# EAGLE schematic Sifteo Thundercracker Master Dev (EAGLE 5.11)
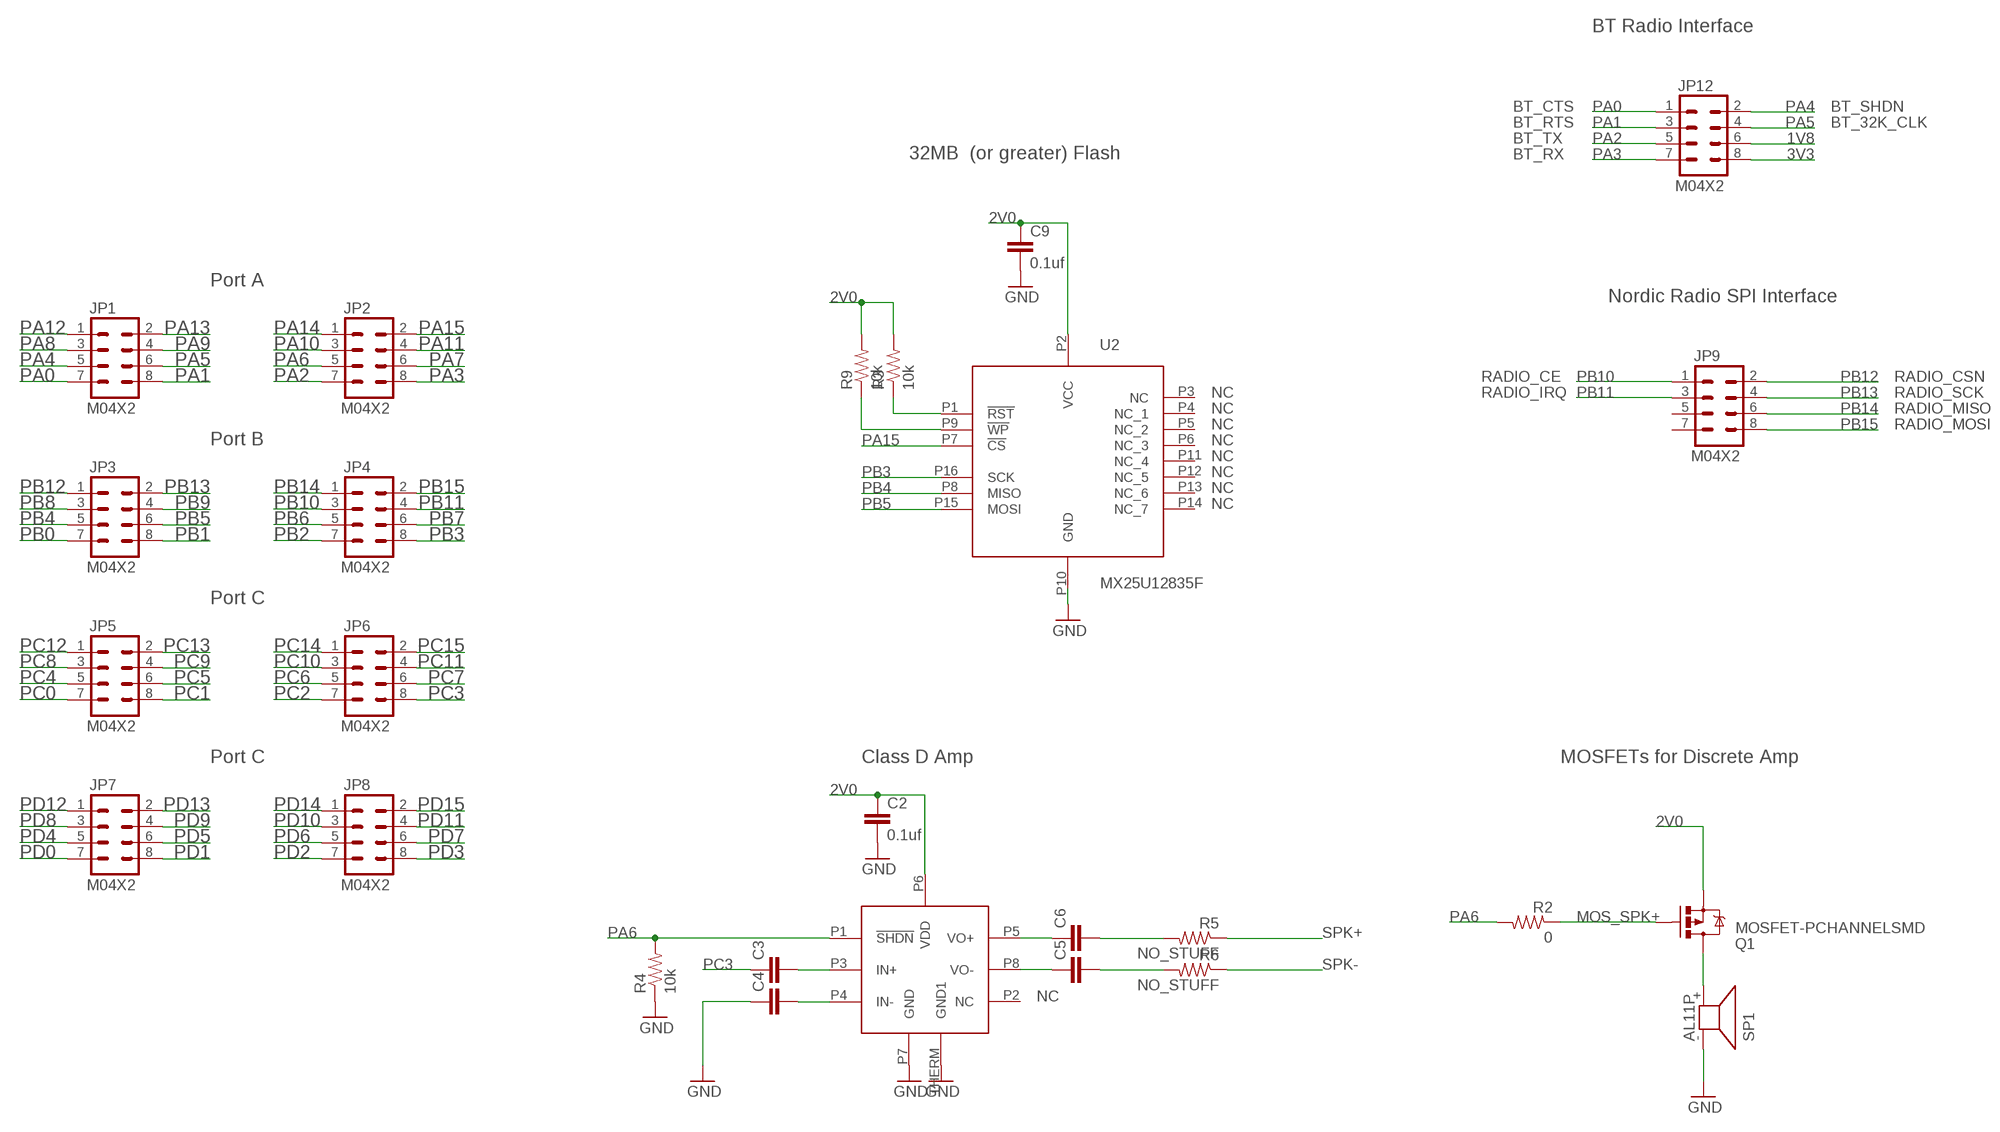
[diagram p0: schematic, sheet 1, part 1 of 2]
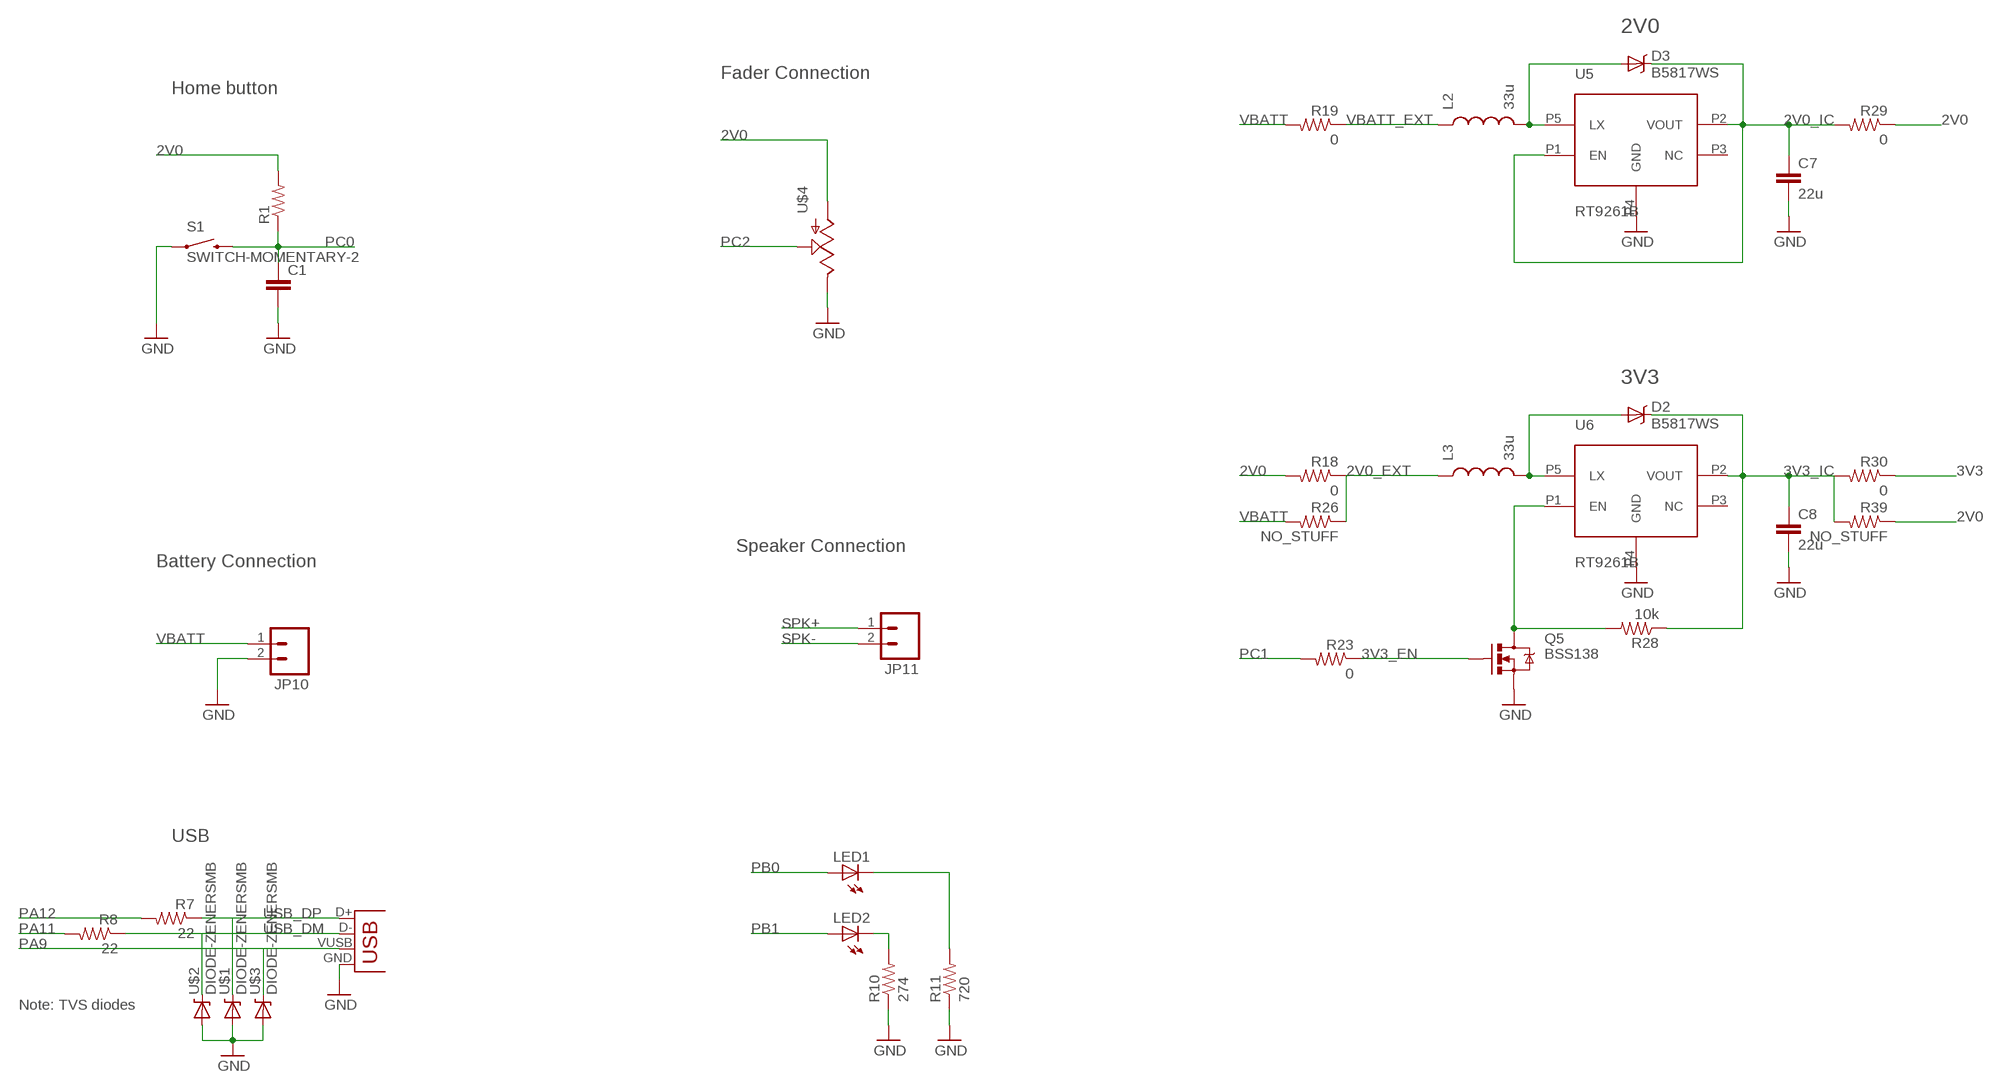
[diagram p1: schematic, sheet 1, part 2 of 2]

## Parts
C1  CAP0603-CAP  [0603-CAP]
C2  0.1uf  CAP0603-CAP  [0603-CAP]
C3  CAP0603-CAP  [0603-CAP]
C4  CAP0603-CAP  [0603-CAP]
C5  CAP0603-CAP  [0603-CAP]
C6  CAP0603-CAP  [0603-CAP]
C7  22u  CAP0603-CAP  [0603-CAP]
C8  22u  CAP0603-CAP  [0603-CAP]
C9  0.1uf  CAP0603-CAP  [0603-CAP]
D2  B5817WS  [SOD-323]
D3  B5817WS  [SOD-323]
JP1  M04X2  [2X4]
JP2  M04X2  [2X4]
JP3  M04X2  [2X4]
JP4  M04X2  [2X4]
JP5  M04X2  [2X4]
JP6  M04X2  [2X4]
JP7  M04X2  [2X4]
JP8  M04X2  [2X4]
JP9  M04X2  [2X4]
JP10  M02PTH  [1X02]
JP11  M02PTH  [1X02]
JP12  M04X2  [2X4]
L2  33u  INDUCTOR0805  [0805]
L3  33u  INDUCTOR0805  [0805]
LED1  LED5MM  [LED5MM]
LED2  LED5MM  [LED5MM]
Q1  MOSFET-PCHANNELSMD  [SOT23-3]
Q5  BSS138  MOSFET-NCHANNELSMD  [SOT23-3]
R1  RESISTOR0603-RES  [0603-RES]
R2  0  RESISTOR0603-RES  [0603-RES]
R3  10k  RESISTOR0603-RES  [0603-RES]
R4  10k  RESISTOR0603-RES  [0603-RES]
R5  NO_STUFF  RESISTOR0603-RES  [0603-RES]
R6  NO_STUFF  RESISTOR0603-RES  [0603-RES]
R7  22  RESISTOR0603-RES  [0603-RES]
R8  22  RESISTOR0603-RES  [0603-RES]
R9  10k  RESISTOR0603-RES  [0603-RES]
R10  274  RESISTOR0603-RES  [0603-RES]
R11  720  RESISTOR0603-RES  [0603-RES]
R18  0  RESISTOR0603-RES  [0603-RES]
R19  0  RESISTOR0603-RES  [0603-RES]
R23  0  RESISTOR0603-RES  [0603-RES]
R26  NO_STUFF  RESISTOR0603-RES  [0603-RES]
R28  10k  RESISTOR0603-RES  [0603-RES]
R29  0  RESISTOR0603-RES  [0603-RES]
R30  0  RESISTOR0603-RES  [0603-RES]
R39  NO_STUFF  RESISTOR0603-RES  [0603-RES]
S1  SWITCH-MOMENTARY-2  [TACTILE_SWITCH_TALL]
SP1  AL11P  [AL11P]
U1  TPA2005D1  [8-TSSOP-3MM-WPAD]
U2  MX25U12835F  [16-SOIC-7.5MM]
U5  RT9261B  [SOT-23-5]
U6  RT9261B  [SOT-23-5]
U$1  DIODE-ZENERSMB  [SMB-DIODE]
U$2  DIODE-ZENERSMB  [SMB-DIODE]
U$3  DIODE-ZENERSMB  [SMB-DIODE]
U$4  POT100K_3362U  [3362U]
X1  USB-B-S  [USB-B-SMT]

## Nets
1V8: JP12.6
2V0: C2.1 C9.1 Q1.2(S) R1.2 R3.2 R9.2 R18.2 R29.1 R39.1 U1.P6(VDD) U2.P2(VCC) U$4.P$3(A)
2V0_EXT: L3.1 R18.1 R26.1
2V0_IC: C7.1 D3.P2(C) R29.2 U5.P1(EN) U5.P2(VOUT)
3V3: JP12.8 R30.1
3V3_EN: Q5.1(G) R23.1
3V3_IC: C8.1 D2.P2(C) R28.1 R30.2 R39.2 U6.P2(VOUT)
AMP+: C6.1 U1.P5(VO+)
AMP-: C5.1 U1.P8(VO-)
AMP_INT+: C6.2 R5.2
AMP_INT-: C5.2 R6.2
GND: C1.2 C2.2 C4.1 C7.2 C8.2 C9.2 JP10.2 Q5.2(S) R4.1 R10.1 R11.1 S1.A2 SP1.- U1.P7(GND) U1.THERM(GND1) U2.P10(GND) U5.P4(GND) U6.P4(GND) U$1.A U$2.A U$3.A X1.GND
MOS_SPK+: Q1.1(G) R2.1
N$1: C3.2 U1.P3(IN+)
N$2: C4.2 U1.P4(IN-)
N$3: Q1.3(D) SP1.+
N$4: R3.1 U2.P1(!RST!)
N$5: R9.1 U2.P9(!WP!)
N$7: R10.2
N$8: D3.P1(A) L2.2 U5.P5(LX)
N$9: LED2.K(C)
N$10: LED1.K(C) R11.2
N$12: D2.P1(A) L3.2 U6.P5(LX)
N$13: Q5.3(D) R28.2 U6.P1(EN)
PA0: JP1.7 JP12.1
PA1: JP1.8 JP12.3
PA2: JP2.7 JP12.5
PA3: JP2.8 JP12.7
PA4: JP1.5 JP12.2
PA5: JP1.6 JP12.4
PA6: JP2.5 R2.2 R4.2 U1.P1(!SHDN)
PA7: JP2.6
PA8: JP1.3
PA9: JP1.4 U$3.C X1.VUSB(VBUS)
PA10: JP2.3
PA11: JP2.4 R8.2
PA12: JP1.1 R7.2
PA13: JP1.2
PA14: JP2.1
PA15: JP2.2 U2.P7(!CS)
PB0: JP3.7 LED1.A
PB1: JP3.8 LED2.A
PB2: JP4.7
PB3: JP4.8 U2.P16(SCK)
PB4: JP3.5 U2.P8(MISO)
PB5: JP3.6 U2.P15(MOSI)
PB6: JP4.5
PB7: JP4.6
PB8: JP3.3
PB9: JP3.4
PB10: JP4.3 JP9.1
PB11: JP4.4 JP9.3
PB12: JP3.1 JP9.2
PB13: JP3.2 JP9.4
PB14: JP4.1 JP9.6
PB15: JP4.2 JP9.8
PC0: C1.1 JP5.7 R1.1 S1.B2
PC1: JP5.8 R23.2
PC2: JP6.7 U$4.P$2(S)
PC3: C3.1 JP6.8
PC4: JP5.5
PC5: JP5.6
PC6: JP6.5
PC7: JP6.6
PC8: JP5.3
PC9: JP5.4
PC10: JP6.3
PC11: JP6.4
PC12: JP5.1
PC13: JP5.2
PC14: JP6.1
PC15: JP6.2
PD0: JP7.7
PD1: JP7.8
PD2: JP8.7
PD3: JP8.8
PD4: JP7.5
PD5: JP7.6
PD6: JP8.5
PD7: JP8.6
PD8: JP7.3
PD9: JP7.4
PD10: JP8.3
PD11: JP8.4
PD12: JP7.1
PD13: JP7.2
PD14: JP8.1
PD15: JP8.2
SPK+: JP11.1 R5.1
SPK-: JP11.2 R6.1
USB_DM: R8.1 U$2.C X1.D-
USB_DP: R7.1 U$1.C X1.D+
VBATT: JP10.1 R19.2 R26.2
VBATT_EXT: L2.1 R19.1
Unconnected: JP9.5 JP9.7 U1.P2(NC) U2.P3(NC) U2.P4(NC_1) U2.P5(NC_2) U2.P6(NC_3) U2.P11(NC_4) U2.P12(NC_5) U2.P13(NC_6) U2.P14(NC_7) U5.P3(NC) U6.P3(NC) U$4.P$1(E)

## Notes on the sheet
- BT Radio Interface
- BT_CTS | BT_SHDN
- BT_RTS | BT_32K_CLK
- BT_TX
- 32MB  (or greater) Flash | BT_RX
- 2V0
- Fader Connection
- Home button
- Port A
- Nordic Radio SPI Interface
- RADIO_CE | RADIO_CSN
- NC | RADIO_IRQ | RADIO_SCK
- NC | RADIO_MISO
- NC | RADIO_MOSI
- Port B | NC
- NC
- NC
- NC
- NC
- 3V3
- Port C
- Speaker Connection
- Battery Connection
- Port C | Class D Amp | MOSFETs for Discrete Amp
- NC
- USB
- Note: TVS diodes

## Library data of the parts
C1-C9 = SparkFun:CAP: Capacitor Standard 0603 ceramic capacitor, and 0.1" leaded capacitor.
D2 D3 = Sifteo:B5817WS: All prices are in US dollars. Digi-Key Part Number B5817WS-TPMSCT-ND Price Break Unit Price Extended Price 1 0.53000 0.53 10 0.38000 3.80 100 0.22800 22.80 250 0.16152 40.38 500 0.12920 64.60 1,000 0.09880 98.80 Quantity Available 20,155 Note <http://ordering.digikey.com/Help.aspx?id=Quantity%20Available%20Note&site=US&lang=EN> Manufacturer Micro Commercial Co <http://digikey.com/Suppliers/us/Micro-Commercial-Components.page?lang=EN> Manufacturer Part Number B5817WS-TP Description DIODE SCHOTTKY 1A 20V SOD-323 Lead Free Status / RoHS Status Lead free / RoHS Compliant Datasheets B5817-19WS <http://61.222.192.61/mccsemi/up_pdf/B5817WS-B5819WS(SOD-323).PDF> Product Photos SOD-323 <http://media.digikey.com/Renders/Micro%20Commercial%20Renders/SOD-323.jpg> Product Training Modules Diode Handling and Mounting <http://digikey.com/PTM/IndividualPTM.page?site=us&lang=en&ptm=24932&WT.pn_sku=B5817WS-TPMSCT-ND&WT.z_ptm_source=Part_Detail> Catalog Drawings MCC Diode SOD-323 Pkg <http://media.digikey.com/pdf/Catalog%20Drawings/Diodes/BAV19WS_1-v1.jpg> Standard Package <http://dkc1.digikey.com/US/EN/help/help14.html> 1 Category Discrete Semiconductor Products Family Diodes, Rectifiers - Single Series - Diode Type Schottky Voltage - DC Reverse (Vr) (Max) 20V Current - Average Rectified (Io) 1A Voltage - Forward (Vf) (Max) @ If 450mV @ 1A Speed Fast Recovery =< 500ns, > 200mA (Io) Reverse Recovery Time (trr) - Current - Reverse Leakage @ Vr 1mA @ 20V Capacitance @ Vr, F - Mounting Type Surface Mount Package / Case SOD-323-2 Supplier Device Package SOD-323 Packaging <http://dkc1.digikey.com/US/EN/help/help14.html> Cut Tape (CT) Catalog Page 1411 (US2011 Interactive) <http://onlinecatalog.digikey.com/?pagelabel=1411> 1411 (US2011 PDF) <http://dkc3.digikey.com/PDF/US2011/P1411.pdf> Other Names B5817WS-TPMSCT
JP1-JP9 JP12 = SparkFun:M04X2
JP10 JP11 = SparkFun:M02: Header 2 Standard 2-pin 0.1" header. Use with straight break away headers (SKU : PRT-00116), right angle break away headers (PRT-00553), swiss pins (PRT-00743), machine pins (PRT-00117), and female headers (PRT-00115). Molex polarized connector foot print use with SKU : PRT-08233 with associated crimp pins and housings.
L2 L3 = SparkFun:INDUCTOR: Inductors Basic Inductor/Choke - 0603 and 1206. Footprints are not proven and vary greatly between part numbers.
LED1 LED2 = SparkFun:LED: LEDs Standard schematic elements and footprints for 5mm, 3mm, 1206, and 0603 sized LEDs. 5mm - Spark Fun Electronics SKU : COM-00529 (and others)
Q1 = SparkFun:MOSFET-PCHANNEL
Q5 = SparkFun:MOSFET-NCHANNEL
R1-R11 R18 R19 R23 R26 R28-R30 R39 = SparkFun:RESISTOR: Resistor Basic schematic elements and footprints for 0603, 1206, and PTH resistors.
S1 = SparkFun:SWITCH-MOMENTARY-2
SP1 = buzzer:AL11P: SPEAKER Source: Buerklin; OC_FARNELL: unknown; OC_NEWARK: unknown
U1 = Sifteo:TPA2005D1: All prices are in US dollars. Digi-Key Part Number 296-26876-2-ND Price Break Unit Price Extended Price 2,500 0.51900 1,297.50 5,000 0.49300 2,465.00 10,000 0.47300 4,730.00 25,000 0.46000 11,500.00 Quantity Available 2,500 Note <http://ordering.digikey.com/Help.aspx?id=Quantity%20Available%20Note&site=US&lang=EN> Manufacturer Texas Instruments <http://digikey.com/Suppliers/us/Texas-Instruments.page?lang=EN> Manufacturer Part Number TPA2005D1DGNR Description IC AMP AUDIO PWR 1.45W D 8MSOP Lead Free Status / RoHS Status Lead free / RoHS Compliant Datasheets TPA2005D1 <http://www.ti.com/lit/ds/symlink/tpa2005d1.pdf> Product Photos DGN-8-MSOP Exp Pad Pkg <http://media.digikey.com/Renders/~~Pkg.Case%20or%20Series/DGN-8-MSOP%20Exp%20Pad%20Pkg.jpg> Standard Package <http://dkc1.digikey.com/US/EN/help/help14.html> 2,500 Category Integrated Circuits (ICs) Family Linear - Amplifiers - Audio Series - Type Class D Output Type 1-Channel (Mono) Max Output Power x Channels @ Load 1.45W x 1 @ 8 Ohm Voltage - Supply 2.5 V ~ 5.5 V Features Differential Inputs, Short-Circuit and Thermal Protection, Shutdown Mounting Type Surface Mount Supplier Device Package 8-MSOP-PowerPad Package / Case 8-TSSOP, 8-MSOP (0.118", 3.00mm Width) Exposed Pad Packaging <http://dkc1.digikey.com/US/EN/help/help14.html> Tape & Reel (TR) Catalog Page 899 (US2011 Interactive) <http://onlinecatalog.digikey.com/?pagelabel=899> 899 (US2011 PDF) <http://dkc3.digikey.com/PDF/US2011/P0899.pdf> For Use With 296-20582-ND </scripts/DkSearch/dksus.dll?Detail&name=296-20582-ND> - EVAL MOD FOR TPA2005D1 Other Names 296-26876-2 TPA2005D1DGNR-ND
U2 = Sifteo:MX25U12835F
U5 U6 = Sifteo:RT9261B: RT9261B General Description The RT9261B Series are VFM Step-up DC/DC converter ICs with ultra low supply current by CMOS process and suitable for use with battery-powered instruments. The RT9261B IC consists of an oscillator, a VFM control circuit, a driver transistor (LX switch), a reference voltage unit, an error amplifier, resistors for voltage detection, and a LX switch protection circuit. A low ripple and high efficiency step-up DC/DC converter can be constructed with the RT9261B IC and only three external components. The EN pin enables the circuit to set the standby supply current at a maximum of 0.5?A.<
U$1-U$3 = SparkFun:DIODE-ZENER: Zener Diode Production Part - 8199 3.4V Zener Voltage
U$4 = SparkFun:POT
X1 = SparkFun:USB: USB Connectors USB-B-PTH is fully proven SKU : PRT-00139 USB-miniB is fully proven SKU : PRT-00587 USB-A-PCB is untested. USB-A-H is throughly reviewed, but untested. Spark Fun Electronics SKU : PRT-00437 USB-B-SMT is throughly reviewed, but untested. Needs silkscreen touching up. USB-A-S has not been used/tested USB-MB-H has not been used/tested